# EAGLE design Teensy Logger Board (EAGLE 7.2.0)
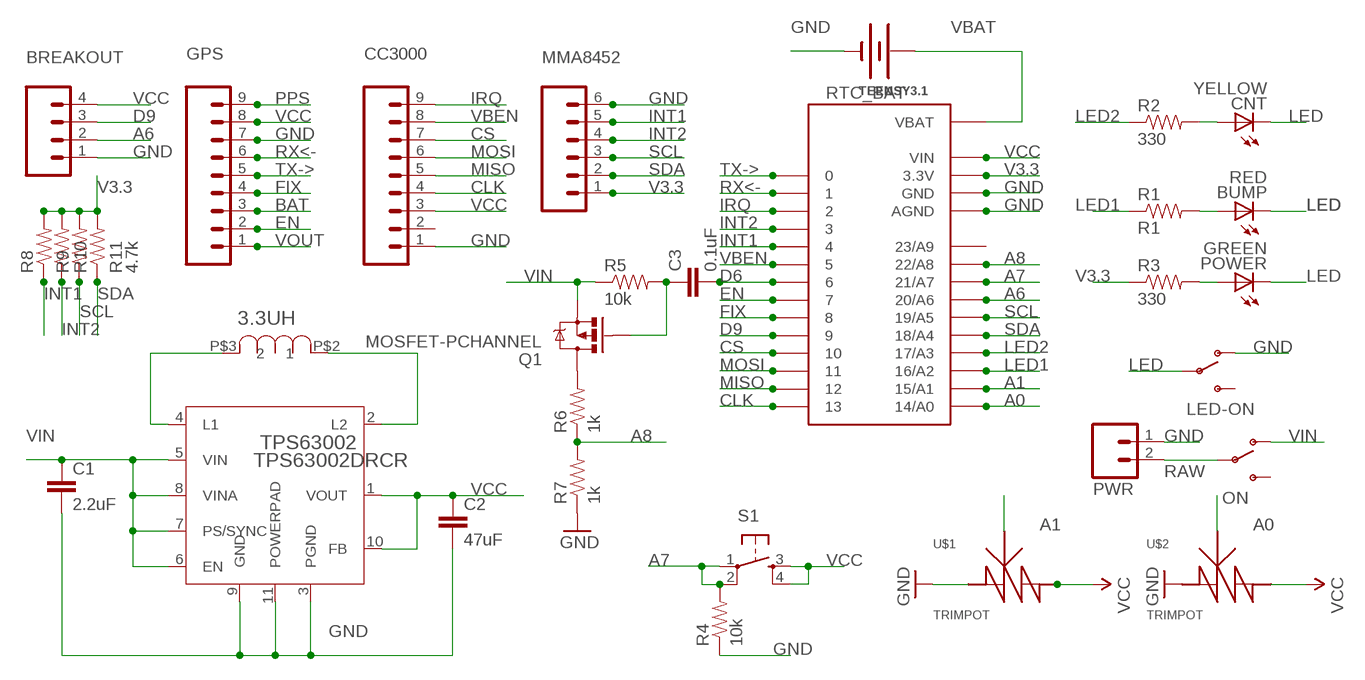
[diagram p0: schematic, sheet 1]

## Parts
3.3UH  SRR4028  [POWERINDUCTOR]
BREAKOUT  M04PTH  [1X04]
BUMP  RED  LEDCHIP-LED0805  [CHIP-LED0805]
C1  2.2uF  22UF-16V-20%-(1210)  [1210]
C2  47uF  1.0UF-25V-+80/-20(0805)  [0805]
C3  0.1uF  1.0UF-25V-+80/-20(0805)  [0805]
CC3000  M09  [1X09]
CNT  YELLOW  LEDCHIP-LED0805  [CHIP-LED0805]
GPS  M09  [1X09]
LED-ON  SWITCH-SPDTPTH  [SWITCH-SPDT]
MMA8452  M06LOCK  [1X06_LOCK]
ON  SWITCH-SPDTPTH  [SWITCH-SPDT]
POWER  GREEN  LEDCHIP-LED0805  [CHIP-LED0805]
PWR  M02JST-PTH-2  [JST-2-PTH]
Q1  MOSFET-PCHANNEL  [SOT23-3]
R1  R1  RESISTOR0805-RES  [0805]
R2  330  RESISTOR0805-RES  [0805]
R3  330  RESISTOR0805-RES  [0805]
R4  10k  RESISTOR0805-RES  [0805]
R5  10k  RESISTOR0805-RES  [0805]
R6  1k  RESISTOR0805-RES  [0805]
R7  1k  RESISTOR0805-RES  [0805]
R8  4.7k  RESISTOR0805-RES  [0805]
R9  4.7k  RESISTOR0805-RES  [0805]
R10  4.7k  RESISTOR0805-RES  [0805]
R11  4.7k  RESISTOR0805-RES  [0805]
RTC_BAT  BATTERY12PTH  [BATTCON_12MM_PTH]
S1  TAC_SWITCHPTH  [TACTILE-PTH]
TEENSY3.1  TEENSY_3.1_WIFI  [TEENSY_3.1_WIFI]
TPS63002  TPS63002DRCR  [NEW-S-PVSON-N10]
U$1  TRIMPOT  [TRIMPOT]
U$2  TRIMPOT  [TRIMPOT]

## Nets
A0: TEENSY3.1.14/A0 U$2.P$1(VAR)
A1: TEENSY3.1.15/A1 U$1.P$1(VAR)
A6: BREAKOUT.2 TEENSY3.1.20/A6
A7: R4.2 S1.1 S1.2 TEENSY3.1.21/A7
A8: R6.1 R7.2 TEENSY3.1.22/A8
BAT: GPS.3
CLK: CC3000.4 TEENSY3.1.13
CS: CC3000.7 TEENSY3.1.10
D6: C3.2 TEENSY3.1.6
D9: BREAKOUT.3 TEENSY3.1.9
EN: GPS.2 TEENSY3.1.7
FIX: GPS.4 TEENSY3.1.8
GND: BREAKOUT.1 C1.2 C2.2 CC3000.1 GPS.7 LED-ON.1(O) MMA8452.6 PWR.1 R4.1 R7.1 RTC_BAT.GND(-) TEENSY3.1.AGND TEENSY3.1.GND TPS63002.3(PGND) TPS63002.9(GND) TPS63002.11(POWERPAD) U$1.P$2(IN) U$2.P$2(IN)
INT1: MMA8452.5 R8.1 TEENSY3.1.4
INT2: MMA8452.4 R9.1 TEENSY3.1.3
IRQ: CC3000.9 TEENSY3.1.2
LED: BUMP.C CNT.C LED-ON.2(P) POWER.C
LED1: R1.1 TEENSY3.1.16/A2
LED2: R2.1 TEENSY3.1.17/A3
MISO: CC3000.5 TEENSY3.1.12
MOSI: CC3000.6 TEENSY3.1.11
N$1: CNT.A R2.2
N$2: BUMP.A R1.2
N$3: POWER.A R3.2
N$4: 3.3UH.P$3 TPS63002.4(L1)
N$5: 3.3UH.P$2 TPS63002.2(L2)
N$6: C3.1 Q1.1(G) R5.2
N$7: Q1.3(D) R6.2
PPS: GPS.9
RAW: ON.2(P) PWR.2
RX<-: GPS.6 TEENSY3.1.1
SCL: MMA8452.3 R10.1 TEENSY3.1.19/A5
SDA: MMA8452.2 R11.1 TEENSY3.1.18/A4
TX->: GPS.5 TEENSY3.1.0
V3.3: MMA8452.1 R3.1 R8.2 R9.2 R10.2 R11.2 TEENSY3.1.3.3V
VBAT: RTC_BAT.VCC@1(+) TEENSY3.1.VBAT
VBEN: CC3000.8 TEENSY3.1.5
VCC: BREAKOUT.4 C2.1 CC3000.3 GPS.8 S1.3 S1.4 TEENSY3.1.VIN TPS63002.1(VOUT) TPS63002.10(FB) U$1.P$3(OUT) U$2.P$3(OUT)
VIN: C1.1 ON.1(O) Q1.2(S) R5.1 TPS63002.5(VIN) TPS63002.6(EN) TPS63002.7(PS/SYNC) TPS63002.8(VINA)
VOUT: GPS.1
Unconnected: CC3000.2 LED-ON.3(S) ON.3(S) TEENSY3.1.23/A9

## Library data of the parts
3.3UH = Bourns_By_element14_Batch_1:SRR4028
BREAKOUT = SparkFun-Connectors:M04: Header 4 Standard 4-pin 0.1" header. Use with straight break away headers (SKU : PRT-00116), right angle break away headers (PRT-00553), swiss pins (PRT-00743), machine pins (PRT-00117), and female headers (PRT-00115). Molex polarized connector foot print use with SKU : PRT-08231 with associated crimp pins and housings. 1MM SMD Version SKU: PRT-10208
BUMP CNT POWER = led:LED: LED OSRAM: - CHIPLED LG R971, LG N971, LY N971, LG Q971, LY Q971, LO R971, LY R971 LH N974, LH R974 LS Q976, LO Q976, LY Q976 LO Q996 - Hyper CHIPLED LW Q18S LB Q993, LB Q99A, LB R99A - SideLED LS A670, LO A670, LY A670, LG A670, LP A670 LB A673, LV A673, LT A673, LW A673 LH A674 LY A675 LS A676, LA A676, LO A676, LY A676, LW A676 LS A679, LY A679, LG A679 - Hyper Micro SIDELED® LS Y876, LA Y876, LO Y876, LY Y876 LT Y87S - SmartLED LW L88C, LW L88S LB L89C, LB L89S, LG L890 LS L89K, LO L89K, LY L89K LS L896, LA L896, LO L896, LY L896 - TOPLED LS T670, LO T670, LY T670, LG T670, LP T670 LSG T670, LSP T670, LSY T670, LOP T670, LYG T670 LG T671, LOG T671, LSG T671 LB T673, LV T673, LT T673, LW T673 LH T674 LS T676, LA T676, LO T676, LY T676, LB T676, LH T676, LSB T676, LW T676 LB T67C, LV T67C, LT T67C, LS T67K, LO T67K, LY T67K, LW E67C LS E67B, LA E67B, LO E67B, LY E67B, LB E67C, LV E67C, LT E67C LW T67C LS T679, LY T679, LG T679 LS T770, LO T770, LY T770, LG T770, LP T770 LB T773, LV T773, LT T773, LW T773 LH T774 LS E675, LA E675, LY E675, LS T675 LS T776, LA T776, LO T776, LY T776, LB T776 LHGB T686 LT T68C, LB T68C - Hyper Mini TOPLED® LB M676 - Mini TOPLED Santana® LG M470 LS M47K, LO M47K, LY M47K Source: http://www.osram.convergy.de LUXEON: - LUMILED® LXK2-PW12-R00, LXK2-PW12-S00, LXK2-PW14-U00, LXK2-PW14-V00 LXK2-PM12-R00, LXK2-PM12-S00, LXK2-PM14-U00 LXK2-PE12-Q00, LXK2-PE12-R00, LXK2-PE12-S00, LXK2-PE14-T00, LXK2-PE14-U00 LXK2-PB12-K00, LXK2-PB12-L00, LXK2-PB12-M00, LXK2-PB14-N00, LXK2-PB14-P00, LXK2-PB14-Q00 LXK2-PR12-L00, LXK2-PR12-M00, LXK2-PR14-Q00, LXK2-PR14-R00 LXK2-PD12-Q00, LXK2-PD12-R00, LXK2-PD12-S00 LXK2-PH12-R00, LXK2-PH12-S00 LXK2-PL12-P00, LXK2-PL12-Q00, LXK2-PL12-R00 Source: www.luxeon.com KINGBRIGHT: KA-3528ASYC Source: www.kingbright.com
C1 = SparkFun-Capacitors:22UF-16V-20%-(1210): CAP-10381; PROD_ID: CAP-10381; VALUE: 22uF
C2 C3 = SparkFun-Capacitors:1.0UF-25V-+80/-20(0805): CAP-11625; PROD_ID: CAP-11625; VALUE: 1.0uF
CC3000 GPS = SparkFun-Connectors:M09: Header 9 Standard 9-pin 0.1" header. Use with straight break away headers (SKU : PRT-00116), right angle break away headers (PRT-00553), swiss pins (PRT-00743), machine pins (PRT-00117), and female headers (PRT-00115).
LED-ON ON = SparkFun-Electromechanical:SWITCH-SPDT: SPDT Switch Simple slide switch, Spark Fun Electronics SKU : COM-00102 DPDT SMT slide switch, AYZ0202, SWCH-08179
MMA8452 = SparkFun-Connectors:M06: Header 6 Standard 6-pin 0.1" header. Use with straight break away headers (SKU : PRT-00116), right angle break away headers (PRT-00553), swiss pins (PRT-00743), machine pins (PRT-00117), and female headers (PRT-00115). Molex polarized connector foot print use with SKU : PRT-08094 with associated crimp pins and housings. NOTES ON THE VARIANTS LOCK and LOCK_LONGPADS... This footprint was designed to help hold the alignment of a through-hole component (i.e. 6-pin header) while soldering it into place. You may notice that each hole has been shifted either up or down by 0.005 of an inch from it's more standard position (which is a perfectly straight line). This slight alteration caused the pins (the squares in the middle) to touch the edges of the holes. Because they are alternating, it causes a "brace" to hold the component in place. 0.005 has proven to be the perfect amount of "off-center" position when using our standard breakaway headers. Although looks a little odd when you look at the bare footprint, once you have a header in there, the alteration is very hard to notice. Also,if you push a header all the way into place, it is covered up entirely on the bottom side. This idea of altering the position of holes to aid alignment will be further integrated into the Sparkfun Library for other footprints. It can help hold any component with 3 or more connection pins.
PWR = SparkFun-Connectors:M02: Standard 2-pin 0.1" header. Use with - straight break away headers ( PRT-00116) - right angle break away headers (PRT-00553) - swiss pins (PRT-00743) - machine pins (PRT-00117) - female headers (PRT-00115) Molex polarized connector foot print use with: PRT-08233 with associated crimp pins and housings. 2.54_SCREWTERM for use with PRT-10571. 3.5mm Screw Terminal footprints for PRT-08084 5mm Screw Terminal footprints for use with PRT-08433; SKU: PRT-09914
Q1 = SparkFun-DiscreteSemi:MOSFET-PCHANNEL: Generic PMOSFET; PROD_ID: TRANS-08285
R1-R11 = SparkFun-Passives:RESISTOR: Resistor Basic schematic elements and footprints for 0603, 1206, and PTH resistors.
RTC_BAT = SparkFun-Electromechanical:BATTERY: Battery Holders Various common sizes : AA, AAA, 20mm coin cell and 12mm coin cell. 20MM_4LEGS, BATT-10373
S1 = SparkFun-Electromechanical:TAC_SWITCH: Momentary Switch Button commonly used for reset or general input. Spark Fun Electronics SKU : COM-00097 SMT- SWCH-08247
TEENSY3.1 = Teensy3.0:TEENSY_3.1_WIFI
TPS63002 = TI TPS63002:TPS63002DRCR
U$1 U$2 = Custom Components:TRIMPOT

## Net classes
0 default: width 0.152 mm, drill 0.33 mm, clearance 0.152 mm

## Board
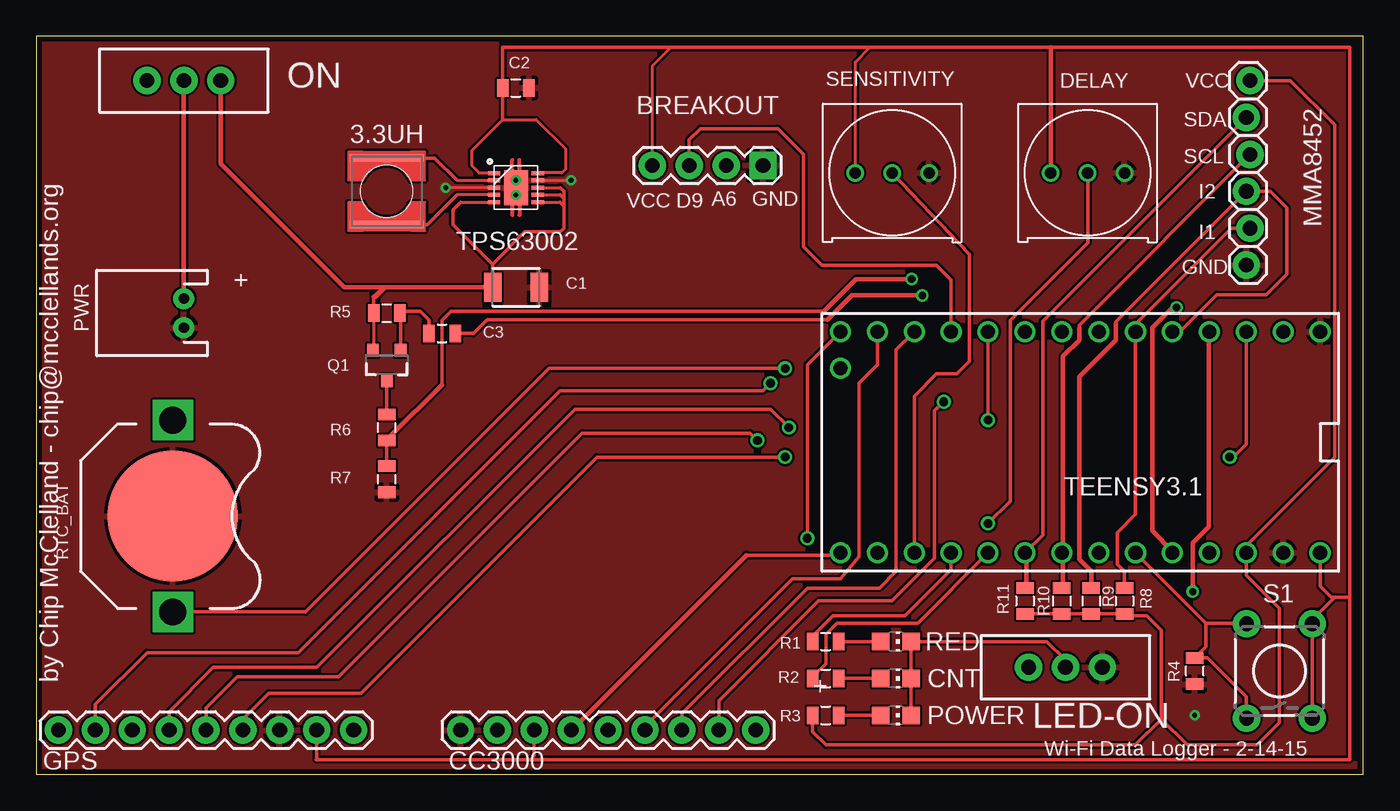
[diagram p1: board, top side]
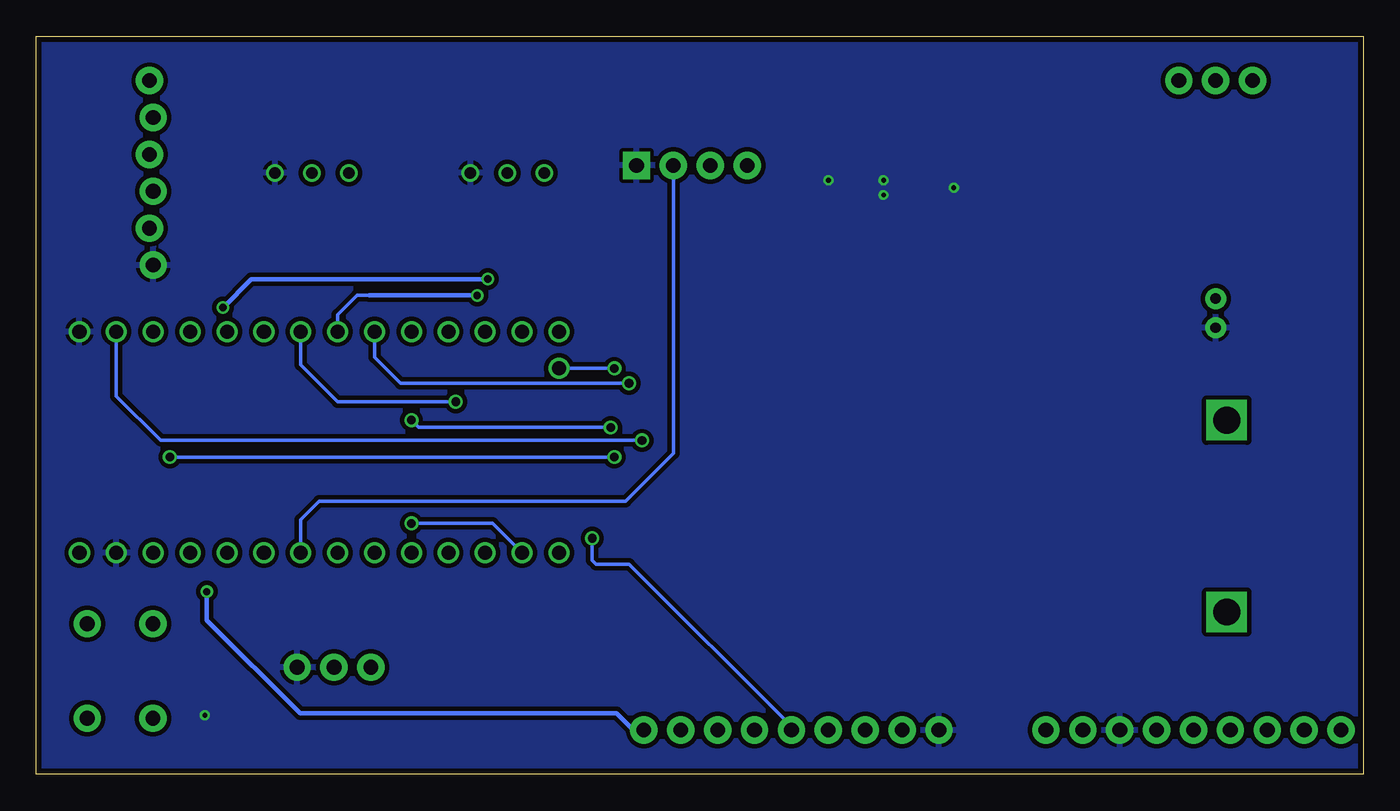
[diagram p2: board, bottom side, seen from below]

Size 91.36 x 50.8 mm. Coordinates in mm from the lower left corner, seen from the top.
Outline: 0,0 91.36,0 91.36,50.8 0,50.8 0,0
Copper layers (1*16): Top 0.0356mm / dielectric 1.5011mm / Bottom 0.0356mm
Design rules "LaenPCBOrder *": minimum track width 6mil, minimum drill 13mil, track to track 6mil, track to pad 6mil, pad to pad 6mil, via to via 6mil, smd to smd 6mil, copper to edge 15mil, drill to drill 6mil, minimum pad ring 7mil, minimum via ring 7mil, stop-mask expansion 3mil, vias tented up to drill 0mil, thermal gap 10mil

### Footprints (pad centres in the part's own frame; a part is rotated, then mirrored left to right if it is on the bottom)
POWERINDUCTOR = smd 5.08 x 0.508: P$2 0,2.286; P$3 0,-2.286
1X04 = drill 1.016 pad 1.88 square: 1 0,0 | drill 1.016 pad 1.88: 2 2.54,0; 3 5.08,0; 4 7.62,0
CHIP-LED0805 = smd 1.2 x 1.2: A 0,-1.05; C 0,1.05
1210 = smd 1.2 x 2: 1 -1.6,0; 2 1.6,0
0805 = smd 0.8 x 1.2: 1 -0.9,0; 2 0.9,0
1X09 = drill 1.016 pad 1.88: 1 0,0; 2 2.54,0; 3 5.08,0; 4 7.62,0; 5 10.16,0; 6 12.7,0; 7 15.24,0; 8 17.78,0; 9 20.32,0
SWITCH-SPDT = drill 1.016 pad 1.88: 1 0,2.54; 2 0,0; 3 0,-2.54
1X06_LOCK = drill 1.016 pad 1.88: 1 0,0; 2 2.54,-0.254; 3 5.08,0; 4 7.62,-0.254; 5 10.16,0; 6 12.7,-0.254
JST-2-PTH = drill 0.7 pad 1.448: 1 -1,0; 2 1,0
SOT23-3 = smd 0.8 x 0.9: 1 -0.95,-1; 2 0.95,-1; 3 0,1.1
BATTCON_12MM_PTH = smd 9 x 9: GND 0,0 | drill 1.854 square: VCC@1 6.604,0; VCC@2 -6.604,0
TACTILE-PTH = drill 1.016 pad 1.88: 1 -3.251,2.261; 2 3.251,2.261; 3 -3.251,-2.261; 4 3.251,-2.261
TEENSY_3.1_WIFI = drill 0.965: 0 -7.62,13.97; 1 -7.62,11.43; 2 -7.62,8.89; 3 -7.62,6.35; 3.3V 7.62,11.43; 4 -7.62,3.81; 5 -7.62,1.27; 6 -7.62,-1.27; 7 -7.62,-3.81; 8 -7.62,-6.35; 9 -7.62,-8.89; 10 -7.62,-11.43; 11 -7.62,-13.97; 12 -7.62,-16.51; 13 7.62,-16.51; 14/A0 7.62,-13.97; 15/A1 7.62,-11.43; 16/A2 7.62,-8.89; 17/A3 7.62,-6.35; 18/A4 7.62,-3.81; 19/A5 7.62,-1.27; 20/A6 7.62,1.27; 21/A7 7.62,3.81; 22/A8 7.62,6.35; 23/A9 7.62,8.89; AGND 7.62,13.97; GND -7.62,16.51; VBAT -5.08,-16.51; VIN 7.62,16.51
NEW-S-PVSON-N10 = smd 0.85 x 0.28: 1 -1.5,1; 2 -1.5,0.5; 3 -1.5,0; 4 -1.5,-0.5; 5 -1.5,-1; 6 1.5,-1; 7 1.5,-0.5; 8 1.5,0; 9 1.5,0.5; 10 1.5,1 | smd 1.65 x 2.4: 11 0,0
TRIMPOT = drill 0.8: P$1 0,0; P$2 2.54,0; P$3 -2.54,0

### Placement (x,y rotation side)
3.3UH  24.13,40.13 0 top
BREAKOUT  50.04,41.91 180 top
BUMP  59.18,9.14 270 top
C1  33.02,33.53 0 top
C2  33.02,47.24 0 top
C3  27.94,30.35 0 top
CC3000  29.21,3.05 0 top
CNT  59.18,6.6 270 top
GPS  1.52,3.05 0 top
LED-ON  70.87,7.37 270 top
MMA8452  83.57,47.75 270 top
ON  10.16,47.75 270 top
POWER  59.18,4.06 270 top
PWR  10.16,31.75 90 top
Q1  24.13,28.19 180 top
R1  54.36,9.14 0 top
R2  54.36,6.6 0 top
R3  54.36,4.06 0 top
R4  79.76,7.11 90 top
R5  24.13,31.75 0 top
R6  24.13,23.88 90 top
R7  24.13,20.32 90 top
R8  74.93,11.94 270 top
R9  72.64,11.94 270 top
R10  70.61,11.94 270 top
R11  68.07,11.94 270 top
RTC_BAT  9.4,17.78 270 top
S1  85.6,7.11 90 top
TEENSY3.1  71.88,22.86 270 top
TPS63002  33.02,40.39 0 top
U$1  58.93,41.4 0 top
U$2  72.39,41.4 0 top

### Tracks (layer width: path | path; a pad name or v marks a point on that pad's centre or on a via)
A0  (via drill 0.6 pad 0.25)
  Top 0.254: U$2.P$1 72.39,36.58 67.06,31.24 67.06,18.8 v65.53,17.27
  Bottom 0.254: v65.53,17.27 59.94,17.27 TEENSY3.1.14/A0
A1
  Top 0.254: TEENSY3.1.15/A1 60.45,26.04 61.98,27.56 63.37,27.56 64.26,28.45 64.26,35.81 U$1.P$1
A6
  Bottom 0.254: BREAKOUT.2 47.5,22.1 50.8,18.8 71.88,18.8 73.15,17.53 TEENSY3.1.20/A6
A7
  Top 0.254: TEENSY3.1.21/A7 80.52,10.41 | 80.52,10.41 83.29,10.41 S1.2 | 80.52,10.41 80.52,8.77 R4.2 80.63,8.01 83.31,5.33 83.31,3.89 S1.1
A8  (via drill 0.51)
  Top 0.254: R6.1 R7.2 | 27.94,26.82 27.94,31.24 28.57,31.88 54.23,31.88 54.36,32
  Top 0.305: 27.94,26.82 24.31,23.19 R6.1 | 54.2,31.85 54.36,32 56.44,34.09 v60.27,34.09 | v78.51,32.13 78.23,32.13 76.83,30.73 76.83,16.76 78.23,15.37 TEENSY3.1.22/A8
  Bottom 0.305: v60.27,34.09 76.56,34.09 v78.51,32.13
CLK
  Top 0.254: 48.9,15.09 55.22,15.09 TEENSY3.1.13
  Top 0.305: 48.9,15.09 36.88,3.07 CC3000.4
CS
  Top 0.254: TEENSY3.1.10 59.18,29.21 59.18,13.97 58.04,12.83 53.09,12.83 44.45,4.19 CC3000.7
D6  (via drill 0.51)
  Top 0.254: 54.48,31.29 31.04,31.29 30.1,30.35 C3.2
  Top 0.305: 54.48,31.29 56.16,32.97 v61.01,32.97
  Bottom 0.254: 68.45,32.97 69.27,32.97 70.61,31.62 TEENSY3.1.6
  Bottom 0.305: 68.45,32.97 v61.01,32.97
D9
  Top 0.254: BREAKOUT.3 44.96,43.69 45.72,44.45 51.05,44.45 52.83,42.67 52.83,36.32 54.1,35.05 61.98,35.05 62.99,34.04 TEENSY3.1.9
EN  (via drill 0.6)
  Top 0.254: GPS.2 4.06,4.83 7.62,8.38 18.03,8.38 36.07,26.42 50.04,26.42 v50.55,26.92
  Bottom 0.254: v50.55,26.92 66.29,26.92 68.07,28.7 TEENSY3.1.7
FIX  (via drill 0.6)
  Top 0.254: GPS.4 9.14,4.32 12.19,7.37 19.3,7.37 37.08,25.15 50.55,25.15 v51.82,23.88 | v65.53,24.38 TEENSY3.1.8
  Bottom 0.254: v51.82,23.88 65.02,23.88 v65.53,24.38
GND  (via drill 0.33)
  Top 0.203: TPS63002.3 v28.19,40.39 | TPS63002.9 v36.82,40.89 v36.83,40.89
  other vias: 33.02,40.89 33.02,39.88 79.76,4.06
  pour Bottom (isolate 0.305): -1.27,52.07 -2.29,-2.79 95.25,-3.05 95.76,52.07
  pour Top: -3.05,52.83 96.27,52.83 96.27,-5.08 -3.05,-5.08
INT1
  Top 0.254: MMA8452.5 82.3,37.59 75.69,30.99 TEENSY3.1.4 75.69,17.91 74.42,16.64 74.42,14.48 74.93,13.97 R8.1
INT2
  Top 0.254: TEENSY3.1.3 78.74,30.48 81.28,33.02 84.71,33.02 86.11,34.42 86.11,38.99 84.96,40.13 MMA8452.4 74.32,31.14 74.32,31.01
  Top 0.305: R9.1 72.64,13.97 71.81,14.81 71.81,27.38 74.32,29.9 74.32,31.01
IRQ  (via drill 0.51)
  Top 0.305: v79.63,12.57 79.63,15.93 80.75,17.04 80.75,30.45 TEENSY3.1.2
  Bottom 0.305: v79.63,12.57 79.63,10.62 73.2,4.19 51.41,4.19 50.29,3.07 49.73,3.07 CC3000.9
LED
  Top 0.254: LED-ON.2 70.87,7.87 69.6,9.14 BUMP.C CNT.C POWER.C
LED1
  Top 0.254: R1.1 53.46,9.51 54.86,10.92 59.82,10.92 62.99,14.1 TEENSY3.1.16/A2
LED2
  Top 0.254: R2.1 53.46,6.72 54.36,7.62 54.36,9.65 55.12,10.41 60.71,10.41 TEENSY3.1.17/A3
MISO  (via drill 0.6 pad 0.25)
  Top 0.254: v53.09,16.26 53.09,28.19 TEENSY3.1.12
  Bottom 0.254: CC3000.5 39.37,3.3 50.55,14.48 52.83,14.48 53.09,14.73 v53.09,16.26
MOSI
  Top 0.254: CC3000.6 41.91,3.3 52.07,13.46 55.37,13.46 56.64,14.99 56.64,26.92 57.91,28.19 TEENSY3.1.11
N$1
  Top 0.254: CNT.A R2.2
N$2
  Top 0.254: BUMP.A R1.2
N$3
  Top 0.254: POWER.A R3.2
N$4
  Top 0.203: TPS63002.4 28.96,39.89
  Top 0.254: 28.96,39.89 26.92,37.85 3.3UH.P$3
N$5
  Top 0.203: 28.96,40.89 31.5,40.89
  Top 0.254: 3.3UH.P$2 27.43,42.42 28.96,40.89 | 31.5,40.89 TPS63002.2
N$6
  Top 0.254: Q1.1 25.08,31.7 R5.2 25.16,31.88 26.42,31.88 27.04,31.25 C3.1
N$7
  Top 0.254: Q1.3 R6.2
RAW
  Top 0.305: ON.2 PWR.2
RX<-  (via drill 0.6)
  Top 0.254: GPS.6 14.22,3.81 16,5.59 22.35,5.59 38.61,21.84 v51.56,21.84 | v82.17,21.84 82.42,21.84 83.31,22.73 TEENSY3.1.1
  Bottom 0.254: v51.56,21.84 v82.17,21.84
SCL
  Top 0.254: 71.81,30.73 71.81,30.91 MMA8452.3
  Top 0.305: R10.1 70.69,12.85 70.69,15.09 TEENSY3.1.19/A5 70.69,15.37 70.69,28.78 71.81,29.9 71.81,30.73
SDA
  Top 0.254: TEENSY3.1.18/A4 69.29,16.46 69.29,31.19 MMA8452.2
  Top 0.305: R11.1 68.17,12.85 68.17,15.09 TEENSY3.1.18/A4
TX->  (via drill 0.6)
  Top 0.254: GPS.5 11.68,4.57 13.84,6.73 20.83,6.73 37.59,23.5 49.15,23.5 v49.66,22.99
  Bottom 0.254: v49.66,22.99 82.8,22.99 85.85,26.04 TEENSY3.1.0
V3.3
  Top 0.254: R11.2 R10.2 R9.2 R8.2 75.05,10.92 76.45,10.92 77.47,9.91 77.47,3.81 | 77.47,3.81 79.25,2.03 84.07,2.03 85.6,3.56 85.6,11.43 83.31,13.72 TEENSY3.1.3.3V 83.31,15.75 89.41,21.84 89.41,44.7 86.36,47.75 MMA8452.1 | R3.1 53.46,2.93 54.36,2.03 75.69,2.03 77.47,3.81
VBAT  (via drill 0.6 pad 0.25)
  Top 0.254: v51.56,27.94 35.31,27.94 18.54,11.18 RTC_BAT.VCC@1
  Bottom 0.254: v51.56,27.94 TEENSY3.1.VBAT
VBEN  (via drill 0.6)
  Top 0.254: v62.48,25.65 61.85,25.02 61.85,14.86 58.93,11.94 53.85,11.94 46.99,5.08 CC3000.8
  Bottom 0.254: v62.48,25.65 70.61,25.65 73.15,28.19 TEENSY3.1.5
VCC
  Top 0.203: 31.5,41.38 TPS63002.1 31.5,41.4 30.48,41.4 29.97,41.91 29.97,42.93 32.12,45.07 34.43,45.07 36.45,43.05 36.45,41.66 36.2,41.4 34.54,41.4 TPS63002.10 | BREAKOUT.4 42.42,48.77 43.69,50.04 | U$1.P$3 56.39,49.02 57.4,50.04
  Top 0.254: 32.12,45.07 C2.1 32.12,50.04 43.69,50.04 57.4,50.04 69.85,50.04 90.42,50.04 90.42,12.19 | 90.42,12.19 90.42,1.02 34.04,1.02 | 34.04,1.02 19.3,1.02 | 19.3,1.02 19.28,1.02 | TEENSY3.1.VIN 88.39,12.95 89.15,12.19 89.41,12.19 | 89.41,12.19 90.42,12.19 | 89.41,12.19 87.86,10.64 S1.4 S1.3 | 19.3,1.02 GPS.8 | CC3000.3 34.29,1.27 34.04,1.02
  Top 0.305: 69.85,50.04 U$2.P$3 | 32.13,47.5 C2.1
VIN
  Top 0.203: 29.21,39.37 31.5,39.37 | TPS63002.6 36.05,39.39 | TPS63002.7 36.06,39.89 | TPS63002.8 36.07,40.39 | R5.1 23.23,29.24 Q1.2
  Top 0.254: 31.42,35.13 C1.1 31.29,33.4 | 31.42,35.13 28.7,37.85 28.7,38.86 29.21,39.37 | 31.5,39.37 TPS63002.5 | 36.05,39.39 36.32,39.12 | 36.32,39.12 36.32,37.59 36.07,37.34 33.63,37.34 31.42,35.13 | 36.06,39.89 36.32,39.62 | 36.32,39.62 36.32,39.12 | 36.07,40.39 36.32,40.13 36.32,39.62 | R5.1 23.23,32.88 23.75,33.4
  Top 0.305: ON.1 12.7,42.04 21.21,33.53 24,33.53 | 24,33.53 C1.1 | 23.23,32.88 23.36,32.88 24,33.53

### Text on the board
tPlace: SENSITIVITY | DELAY | VCC | SDA | SCL | I2 | VCC | D9 | A6 | GND | I1 | + | GND | + | by Chip McClelland - chip@mcclellands.org | Wi-Fi Data Logger - 2-14-15